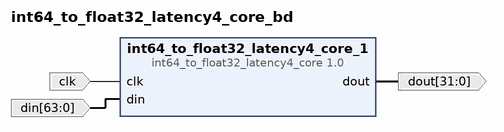
[diagram p0: block diagram of the top level]
# Vivado block design int64_to_float32_latency4_core_bd, xc7k160tffg676-2, Vivado 2019.1.3
create_bd_design int64_to_float32_latency4_core_bd

create_bd_port -dir I -type clk clk
create_bd_port -dir I -from 63 -to 0 -type data din
create_bd_port -dir O -from 31 -to 0 -type data dout

create_bd_cell -type ip -vlnv User_Company:SysGen:int64_to_float32_latency4_core:1.0 int64_to_float32_latency4_core_1

# ---- connections ----

connect_bd_net [get_bd_ports clk] [get_bd_pins int64_to_float32_latency4_core_1/clk]
connect_bd_net [get_bd_ports din] [get_bd_pins int64_to_float32_latency4_core_1/din]
connect_bd_net [get_bd_pins int64_to_float32_latency4_core_1/dout] [get_bd_ports dout]

validate_bd_design
save_bd_design
